# Altium schematic sheet MotorPhase.SchDoc
size A; DocumentNumber: 3; SheetNumber: 3; SheetTotal: 6
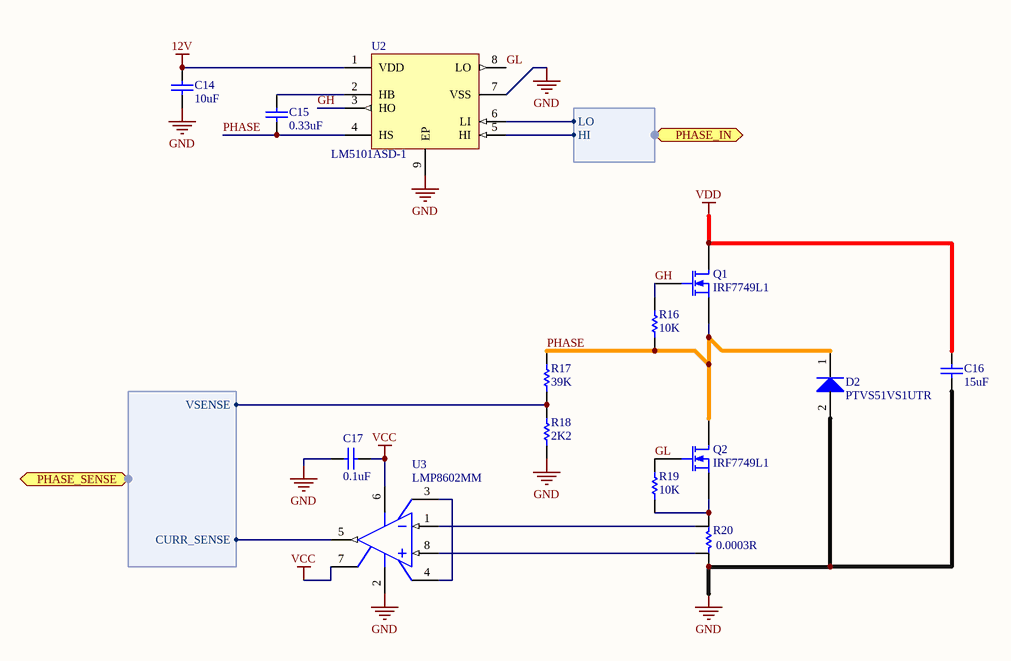
[diagram p0: MotorPhase.SchDoc]

## Parts
C14  value 10uF  [C0603[1608X92]]  (hidden comment: 10uF 16V 0603)
C15  value 0.33uF  [C0603[1608X92]]  (hidden comment: 0.33uF 25V 0603)
C16  value 15uF  [C2220[5750X230]]  (hidden comment: 15uF 100V 2220)
C17  value 0.1uF  [C0402[1005X55]]  (hidden comment: 0.1uF 6.3V 0402)
D2  PTVS51VS1UTR  [SOD-123W]
Q1  IRF7749L1  [DIRECTFET-9]
Q2  IRF7749L1  [DIRECTFET-9]
R16  value 10K  [R0402[1005]]  (hidden comment: 10K 1% 0402)
R17  value 39K  [R0402[1005]]  (hidden comment: 39K 1% 0402)
R18  value 2K2  [R0402[1005]]  (hidden comment: 2K2 1% 0402)
R19  value 10K  [R0402[1005]]  (hidden comment: 10K 1% 0402)
R20  value 0.0003R  [WSL2726]
U2  LM5101ASD-1  [DFN8]
U3  LMP8602MM  [MUA08A_L]

## Ports
PHASE_IN (harness Phase Input), PHASE_SENSE (harness Phase Sense)

## Harnesses
Phase Sense: VSENSE, CURR_SENSE
Phase Input: LO, HI

## Nets
12V: C14.2 U2.1(VDD)
GND: C14.1 C16.1 C17.2 D2.2(A) R18.1 R20.1 U2.7(VSS) U2.9(EP) U3.2(GND)
VCC: C17.1 U3.6(VS) U3.7(OFS)
VDD: C16.2 Q1.3(D)
GH: Q1.1(G) R16.2 U2.3(HO)
GL: Q2.1(G) R19.2 U2.8(LO)
PHASE: C15.1 D2.1(K) Q1.2(S) Q2.3(D) R16.1 R17.2 U2.4(HS)
NetC15_2: C15.2 U2.2(HB)
NetQ2_2: Q2.2(S) R19.1 R20.2
NetR17_1: R17.1 R18.2 ; port PHASE_SENSE.VSENSE
NetR20_3: R20.3 U3.8(IN+)
NetR20_4: R20.4 U3.1(IN-)
NetU2_5: U2.5(HI) ; port PHASE_IN.HI
NetU2_6: U2.6(LI) ; port PHASE_IN.LO
NetU3_3: U3.3(A1) U3.4(A2)
NetU3_5: U3.5(OUT) ; port PHASE_SENSE.CURR_SENSE

## Library data of the parts
C14 = CAP_10uF_16V_0603_10%: 10uF 16V 10% 0603 (1608 Metric); PartNumber: GRM188R61C106KAALD; Manufacturer: Murata; Tolerance: 10%; Mounting Technology: Surface Mount; PackageReference: 0603; PackageDescription: 0603 (1608 Metric); Voltage: 16V
C15 = CAP_0.33uF_25V_0603_10%: 0.33uF 25V 10% 0603 (1608 Metric); PartNumber: GCJ188R91E334KA01D; Manufacturer: Murata; Tolerance: 10%; Mounting Technology: Surface Mount; PackageReference: 0603; PackageDescription: 0603 (1608 Metric); Voltage: 25V
C16 = CAP_15uF_100V_2220_20%: 15uF 100V 20% 2220 (5750 Metric); PartNumber: C5750X7S2A156M250KB; Manufacturer: TDK; Tolerance: 20%; Mounting Technology: Surface Mount; PackageReference: 2220; PackageDescription: 2220 (5750 Metric); Voltage: 100V
C17 = CAP_0.1uF_6.3V_0402_10%: 0.1uF 6.3V 10% 0402 (1005 Metric); PartNumber: GRM155R70J104KA01D; Manufacturer: Murata; Tolerance: 10%; Mounting Technology: Surface Mount; PackageReference: 0402; PackageDescription: 0402 (1005 Metric); Voltage: 6.3V
D2 = PTVS51VS1UTR,115: Manufacturer: NXP; PartNumber: PTVS51VS1UTR,115; PackageReference: SOD-123W; PackageDescription: SOD123W, 2-Leads; Mounting Technology: Surface Mount
Q1 Q2 = IRF7749L2: N-Channel MOSFET; PartNumber: IRF7749L1TRPBF; Manufacturer: Infineon Technologies; PackageReference: DIRECTFET L8; PackageDescription: DirectFET™ Isometric L8; Mounting Technology: Surface Mount
R16 R19 = RES_10K_0402_1%: 10K 0.063W 1% 0402 (1005 Metric); Manufacturer: KOA Speer; PartNumber: RK73H1ETTP1002F; Tolerance: 1%; Power: 0.063W; Mounting Technology: Surface Mount; PackageReference: 0402; PackageDescription: 0402 (1005 Metric); ComponentLink1Description: Datasheet; ComponentLink1URL: http://www.koaspeer.com/catimages/Products/RK73H/RK73H.pdf
R17 = RES_39K_0402_1%: 39K 0.063W 1% 0402 (1005 Metric); Manufacturer: KOA Speer; PartNumber: RK73H1ETTP3902F; Tolerance: 1%; Power: 0.063W; Mounting Technology: Surface Mount; PackageReference: 0402; PackageDescription: 0402 (1005 Metric); ComponentLink1Description: Datasheet; ComponentLink1URL: http://www.koaspeer.com/catimages/Products/RK73H/RK73H.pdf
R18 = RES_2K2_0402_1%: 2K2 0.063W 1% 0402 (1005 Metric); Manufacturer: KOA Speer; PartNumber: RK73H1ETTP2201F; Tolerance: 1%; Power: 0.063W; Mounting Technology: Surface Mount; PackageReference: 0402; PackageDescription: 0402 (1005 Metric); ComponentLink1Description: Datasheet; ComponentLink1URL: http://www.koaspeer.com/catimages/Products/RK73H/RK73H.pdf
R20 = WSL27261L000FEB: Current Sense Resistor, 0.0003R 1%; PartNumber: WSL2726L3000FEB; Manufacturer: Vishay; Power: 3W; PackageReference: 2726; PackageDescription: 2726 (6966 metric); Mounting Technology: Surface Mount
U2 = LM5101ASD-1: Manufacturer: Texas Instruments; PartNumber: LM5101ASD-1; PackageReference: 8-WSON; PackageDescription: 8-WDFN Exposed Pad; Mounting Technology: Surface Mount
U3 = CMP-0055-01489-1: 60V Common Mode, 50 x Gain, Bidirectional Precision Current Sensing Amplifier, 8-pin Mini SOIC, Pb-Free; Manufacturer: Texas Instruments; CompType: Amplifiers; PowerWise: N; PackageTopMarking: ZXTT*AN3A; PackageVersion: revF, Apr-2008; PackageReference: 8-VSSOP; PackageDescription: MINI SOIC, .118 x .118 x .034in, 8 Lead, .0256in Pitch; Code_JEDEC: MO-187-AA; DatasheetVersion: Mar-2010; RoHS: Y; PinCount: 8; PartNumber: LMP8602MM; Mounting Technology: Surface Mount